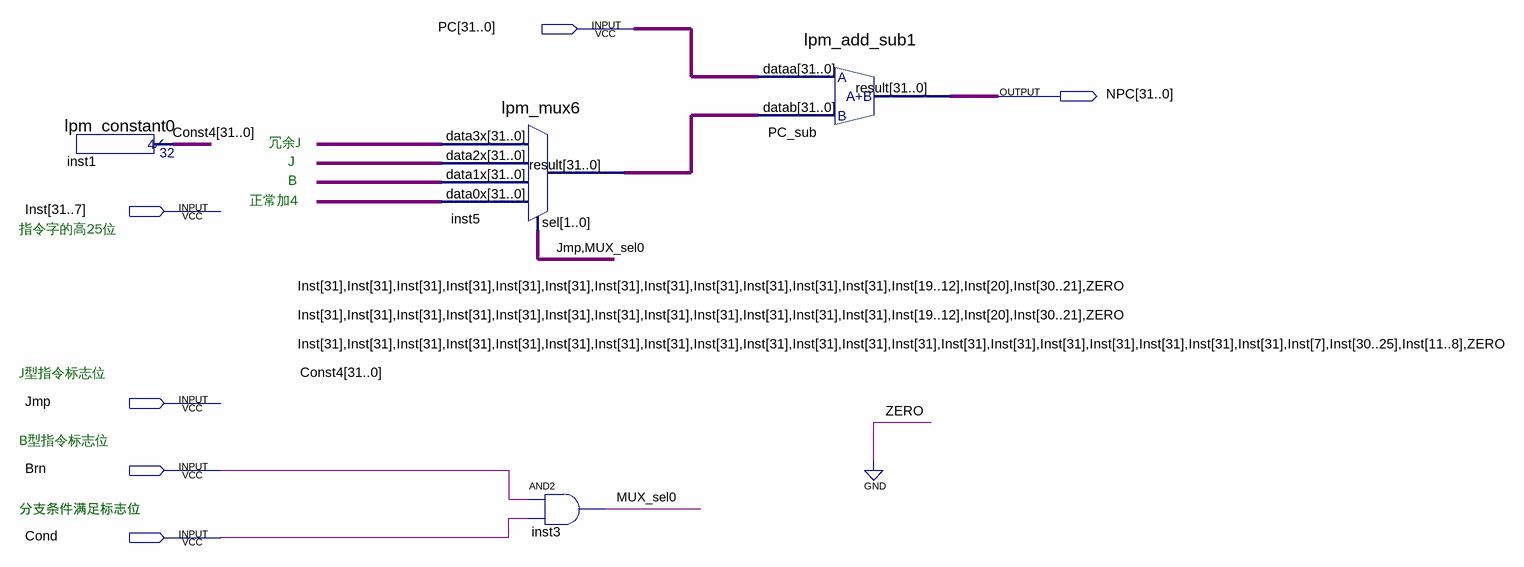
[diagram p0: schematic sheet]
// Quartus schematic ACU.bdf as structural Verilog: 4 symbols, 6 pins
module ACU (
  input  [31:0] PC,
  input  [31:7] Inst,
  input  Jmp,
  input  Brn,
  input  Cond,
  output [31:0] NPC
);

  wire MUX_sel0;
  wire [31:0] Const4, inst5_result;

  lpm_constant0 inst1 (.result(Const4));
  lpm_mux6 inst5 (
    .data3x({{12{Inst[31]}}, Inst[19:12], Inst[20], Inst[30:21], 1'b0}),
    .data2x({{12{Inst[31]}}, Inst[19:12], Inst[20], Inst[30:21], 1'b0}),
    .data1x({{20{Inst[31]}}, Inst[7], Inst[30:25], Inst[11:8], 1'b0}), .data0x(Const4),
    .sel({Jmp, MUX_sel0}), .result(inst5_result));
  and inst3 (MUX_sel0, Brn, Cond);
  lpm_add_sub1 PC_sub (.dataa(PC), .datab(inst5_result), .result(NPC));

  // Notes on the sheet:
  //   冗余J
  //   J
  //   B
  //   正常加4
  //   指令字的高25位
  //   J型指令标志位
  //   B型指令标志位
  //   分支条件满足标志位
endmodule
